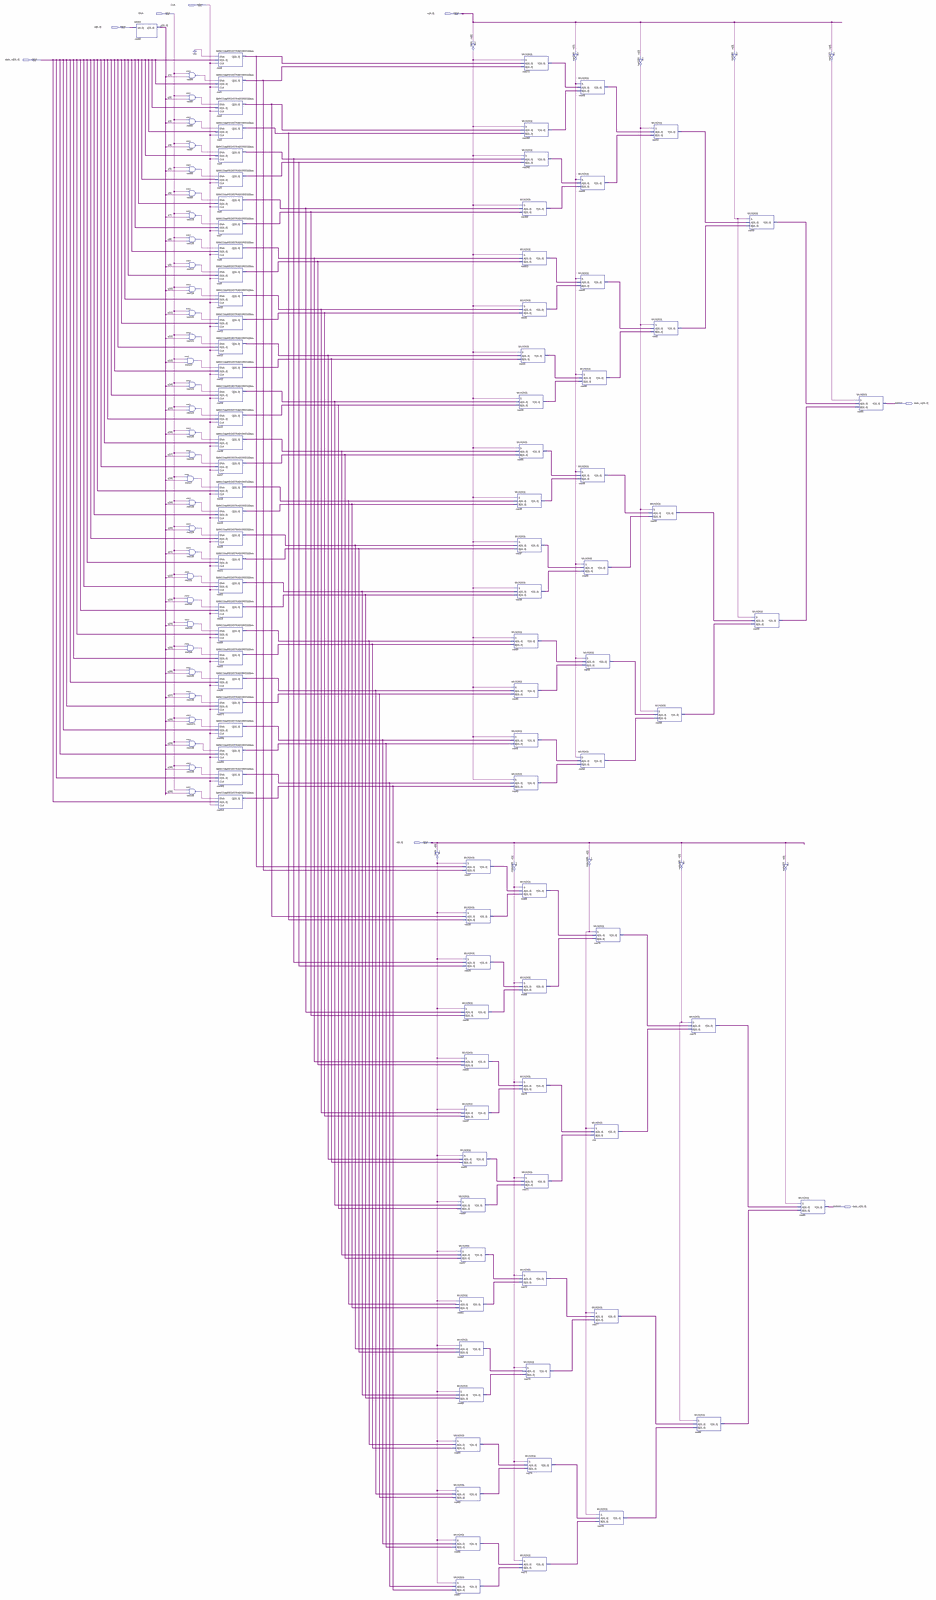
[diagram p0: schematic sheet, whole]
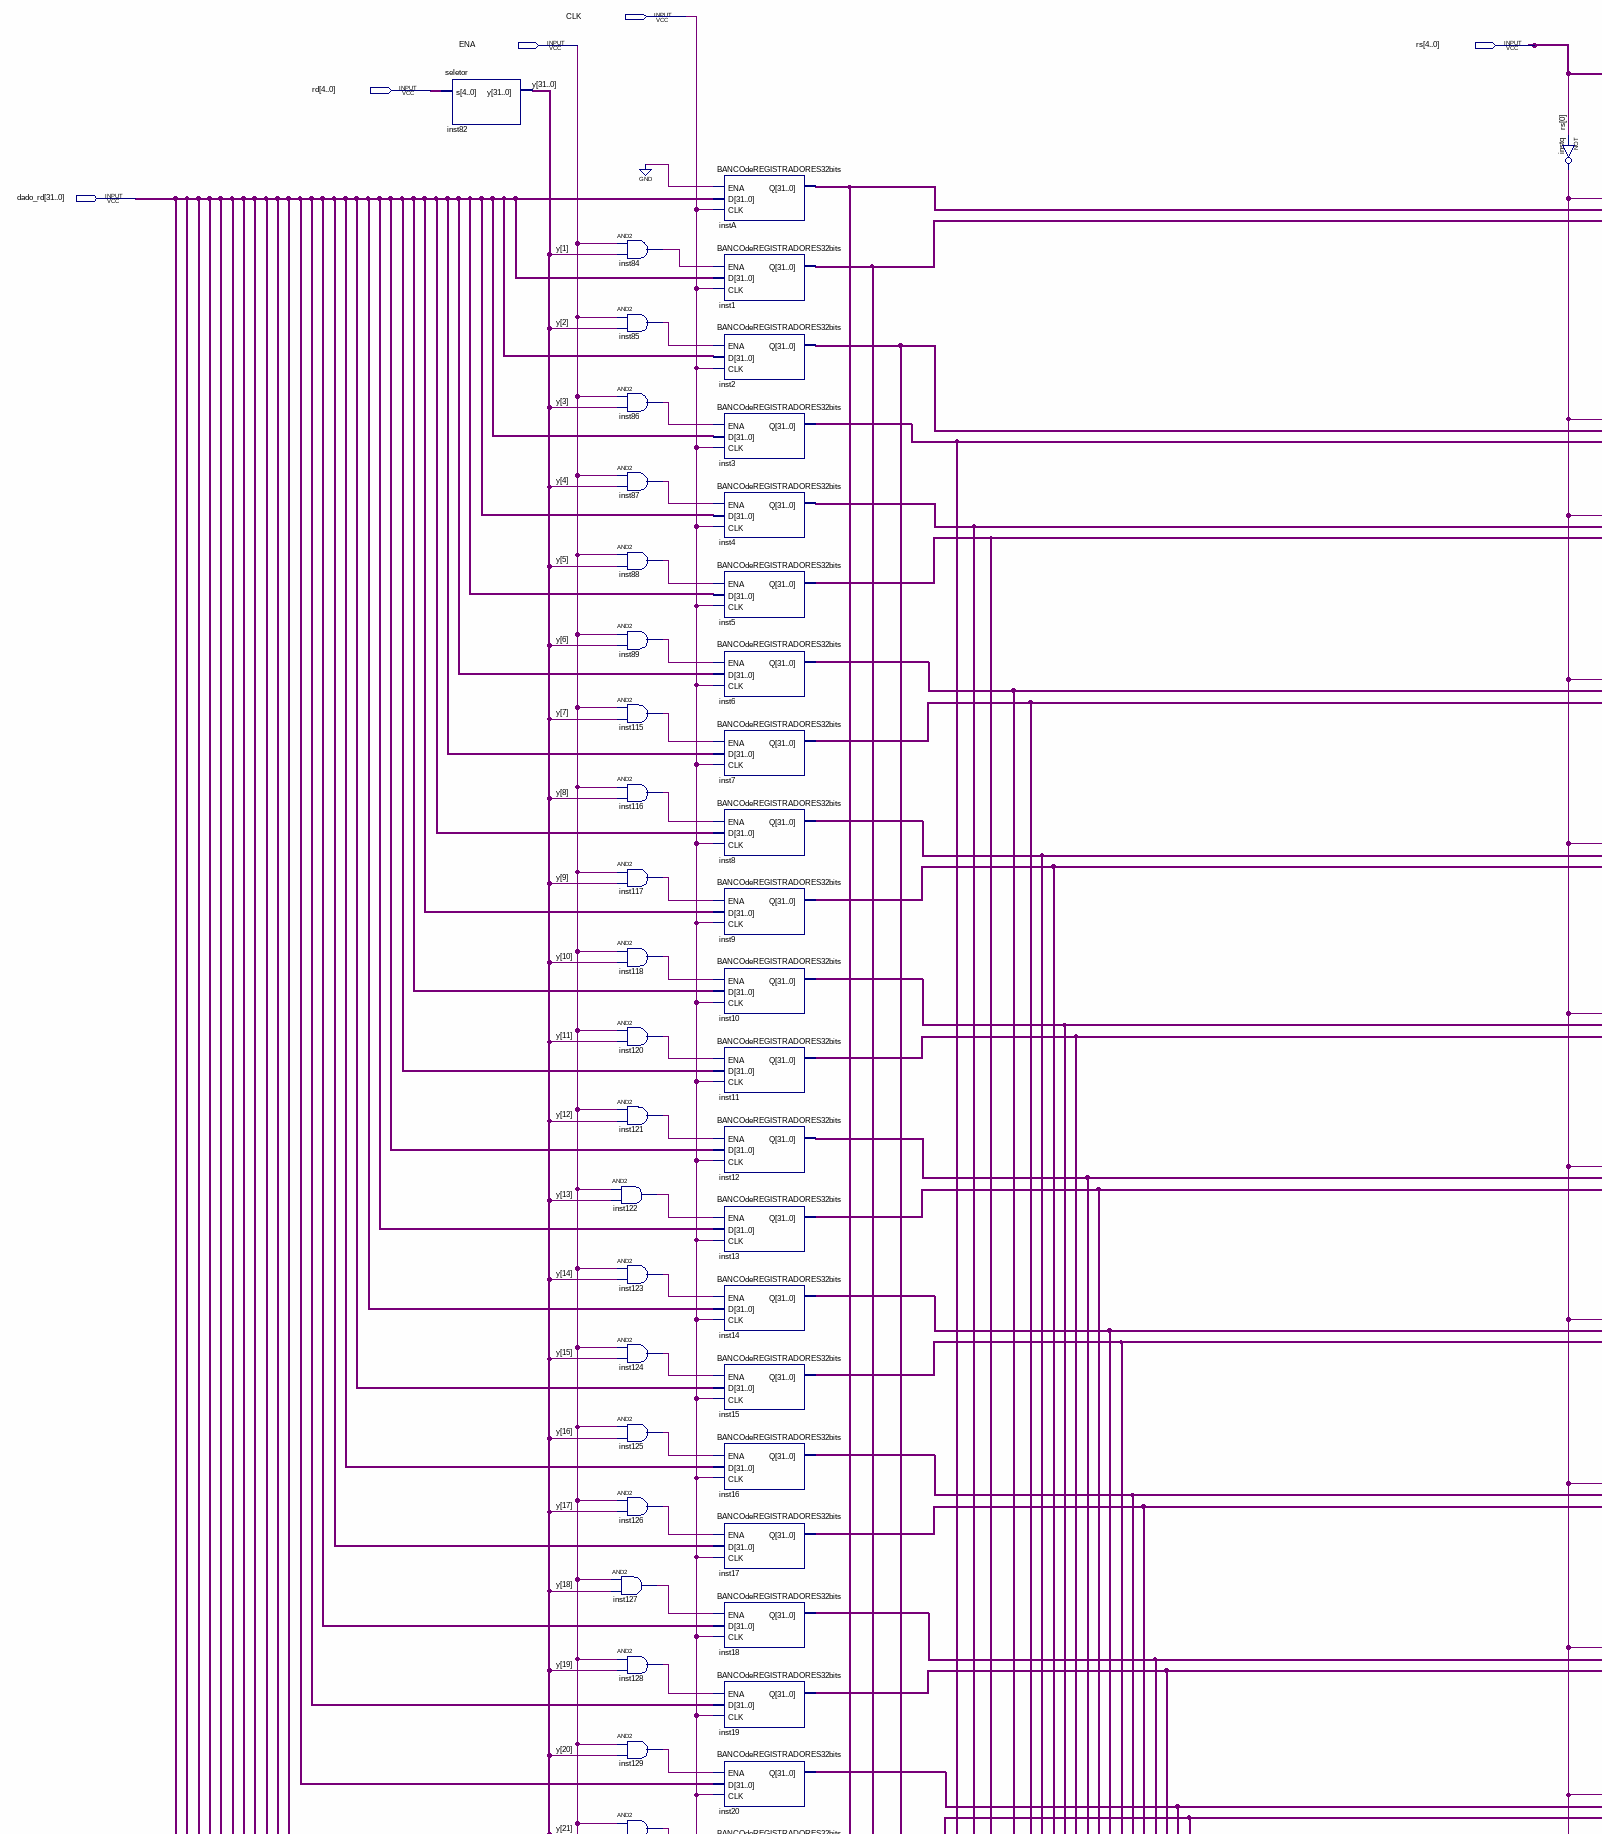
[diagram p1: schematic sheet, upper left part]
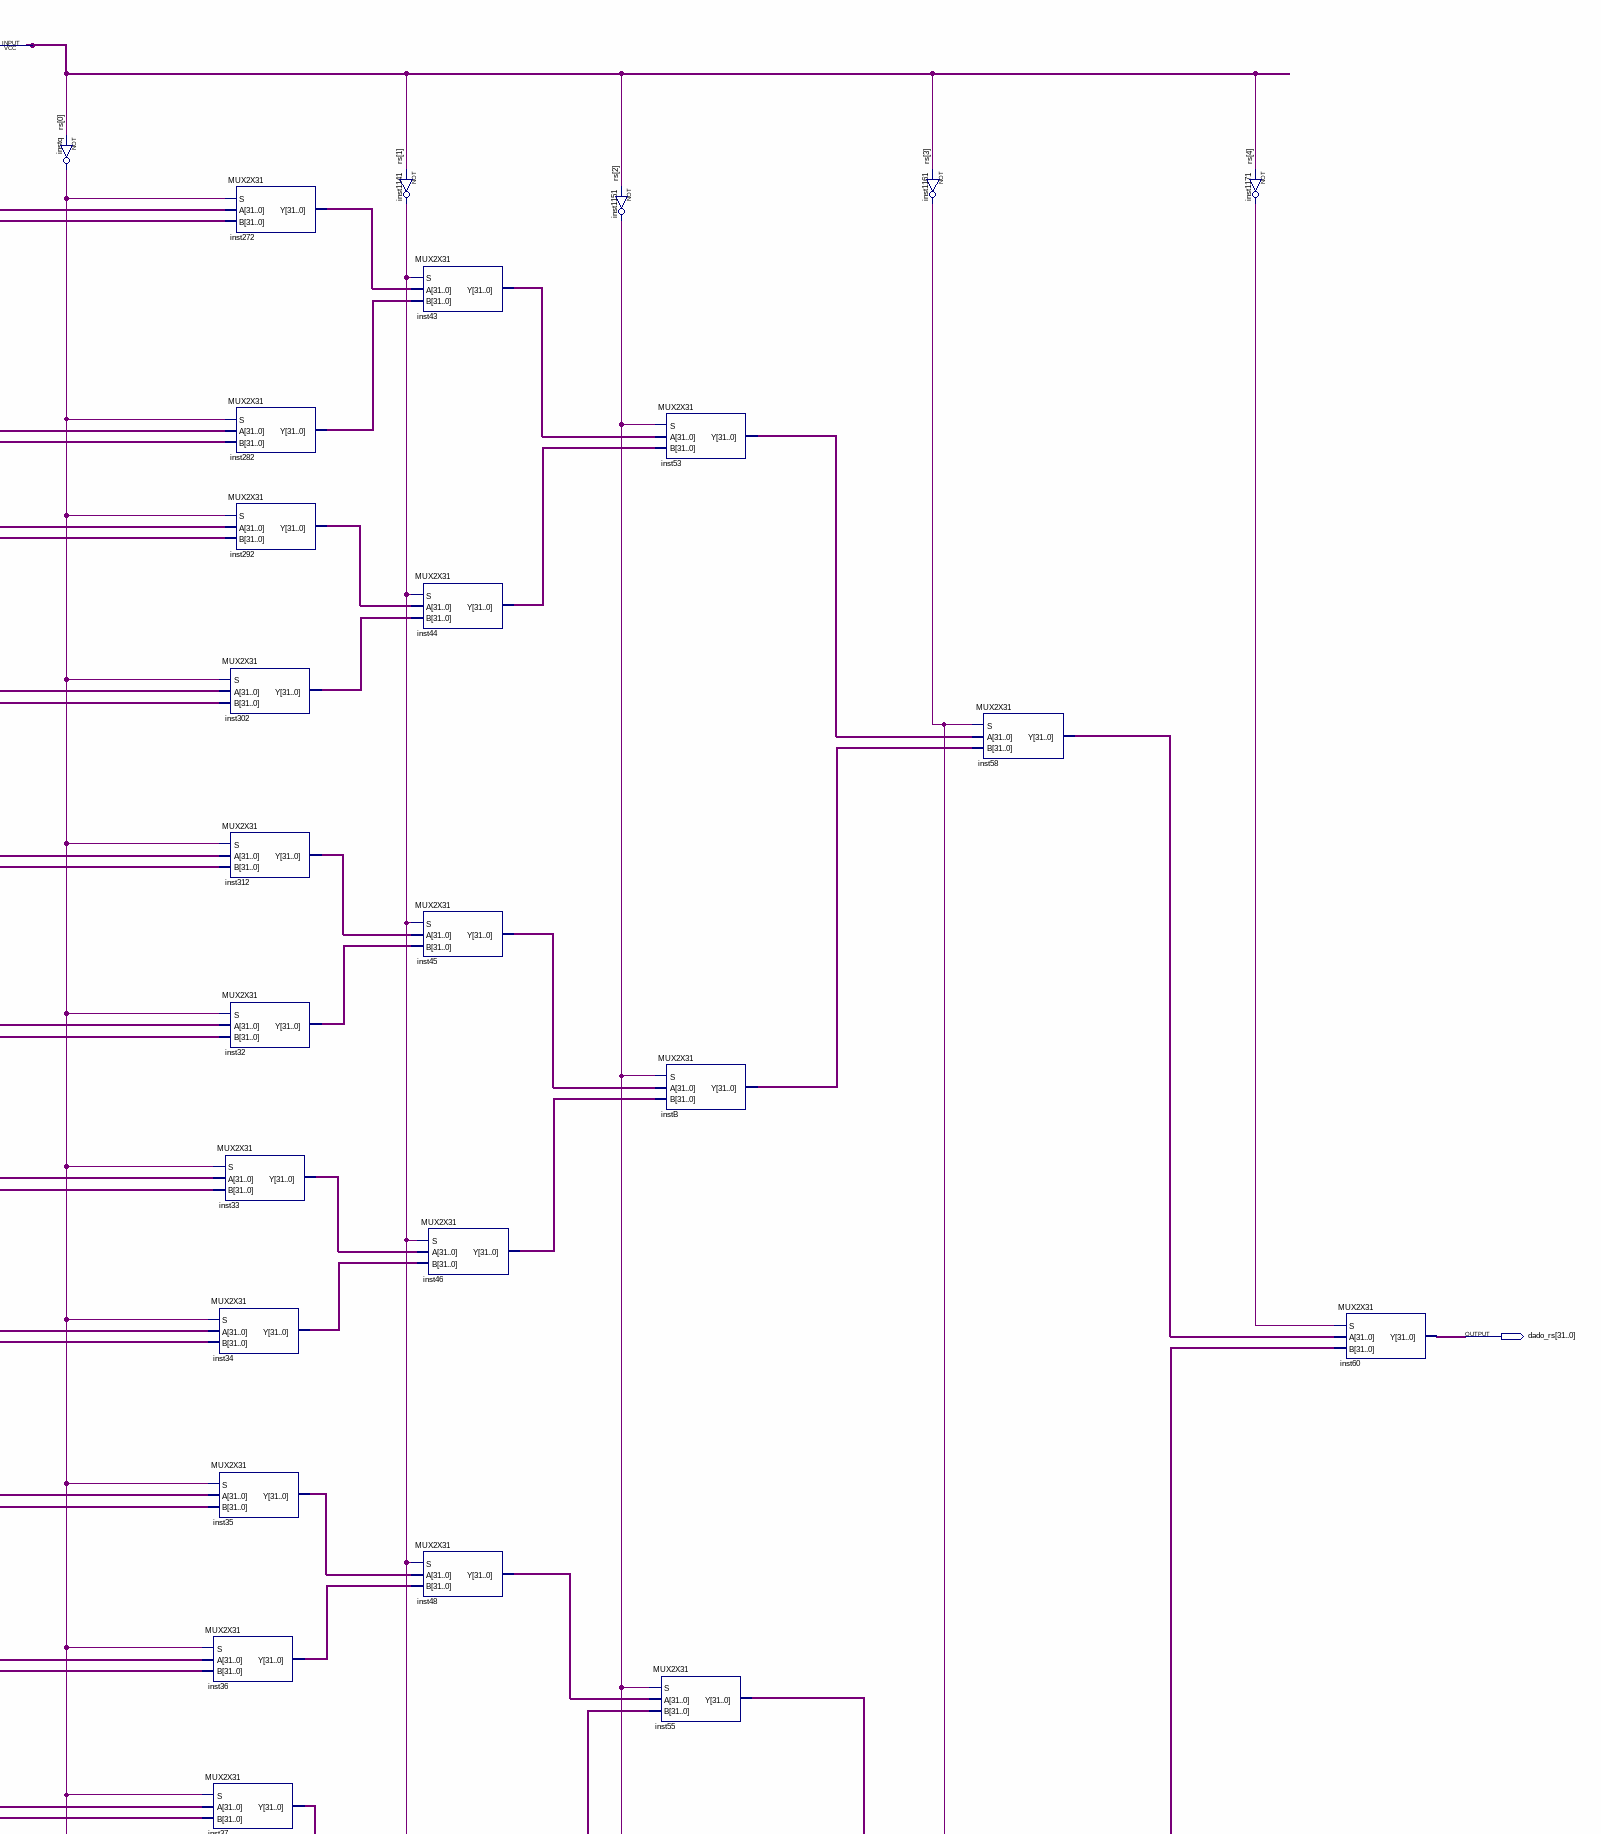
[diagram p2: schematic sheet, upper right part]
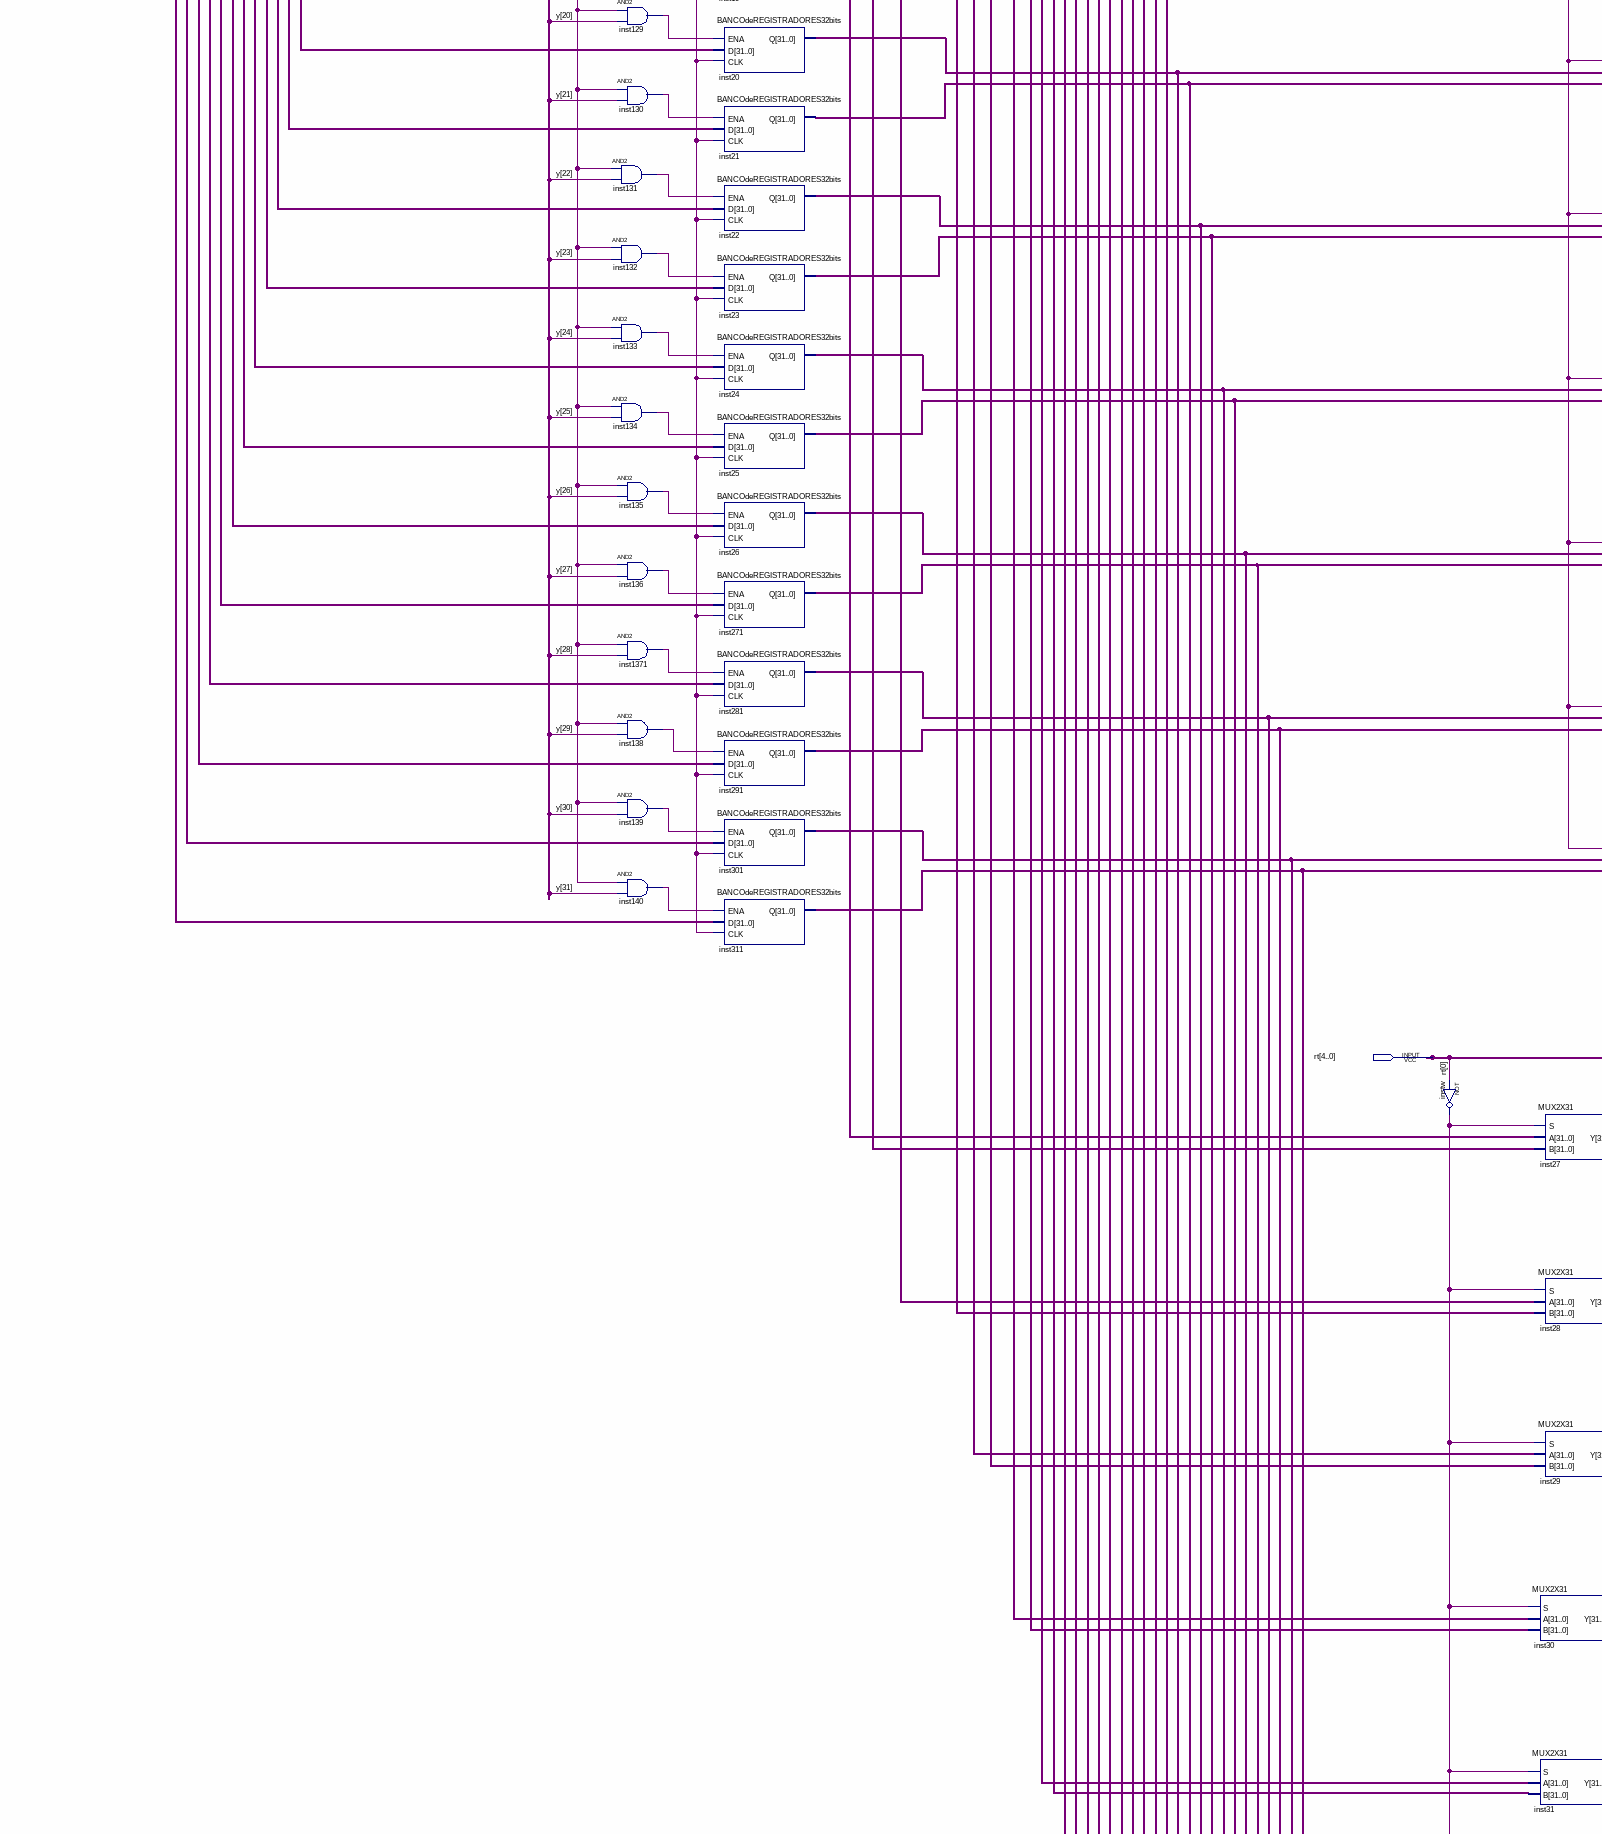
[diagram p3: schematic sheet, middle left part]
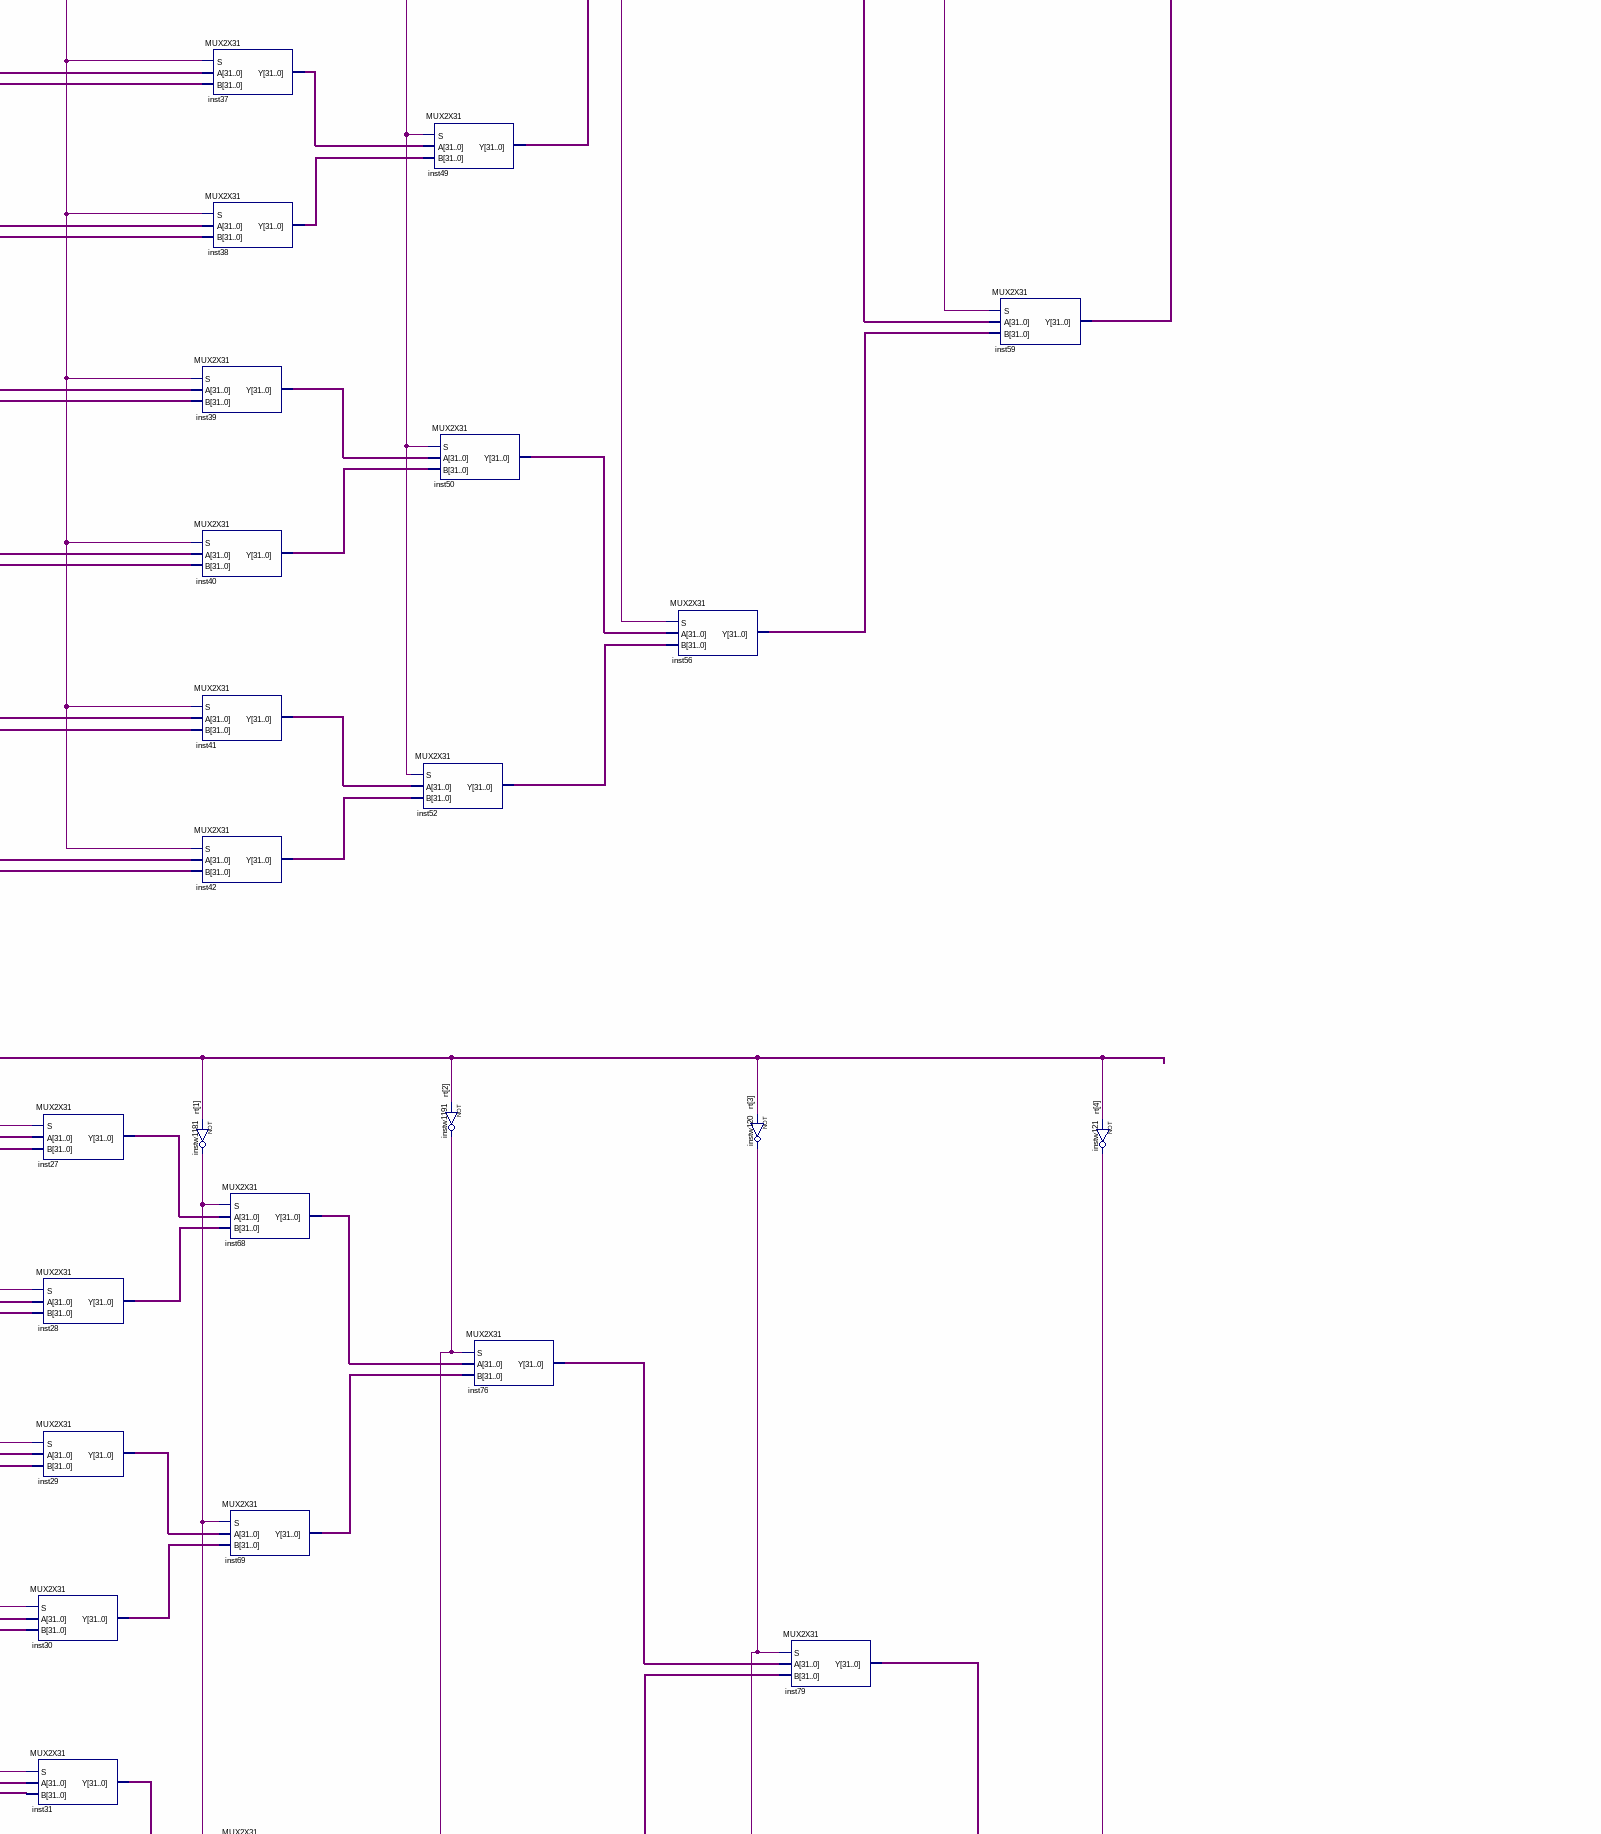
[diagram p4: schematic sheet, middle right part]
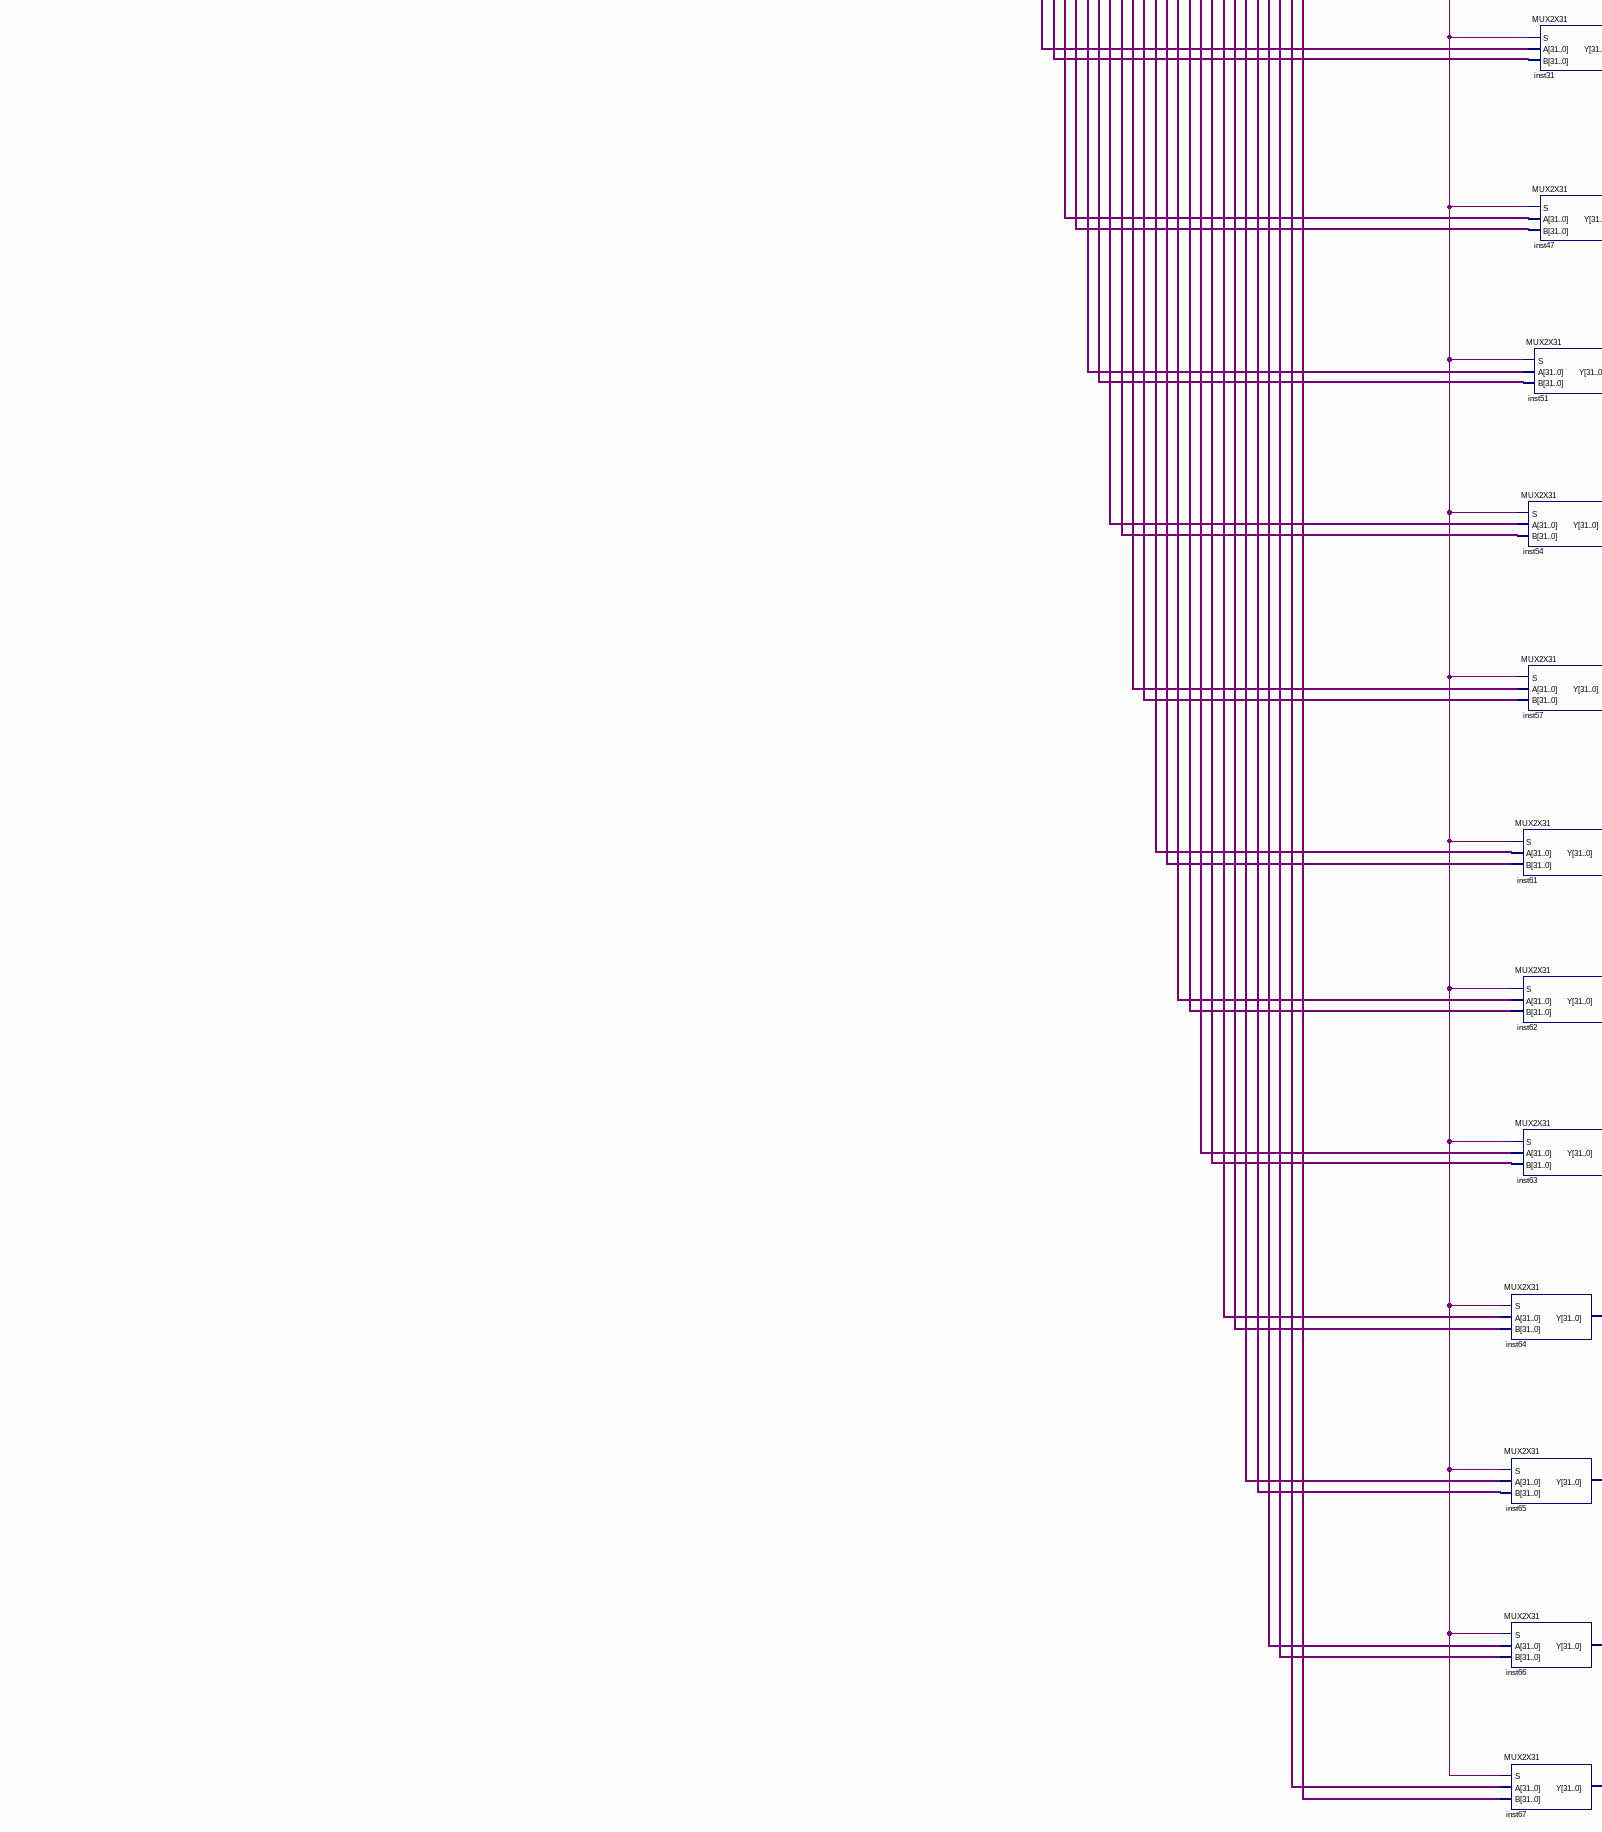
[diagram p5: schematic sheet, lower left part]
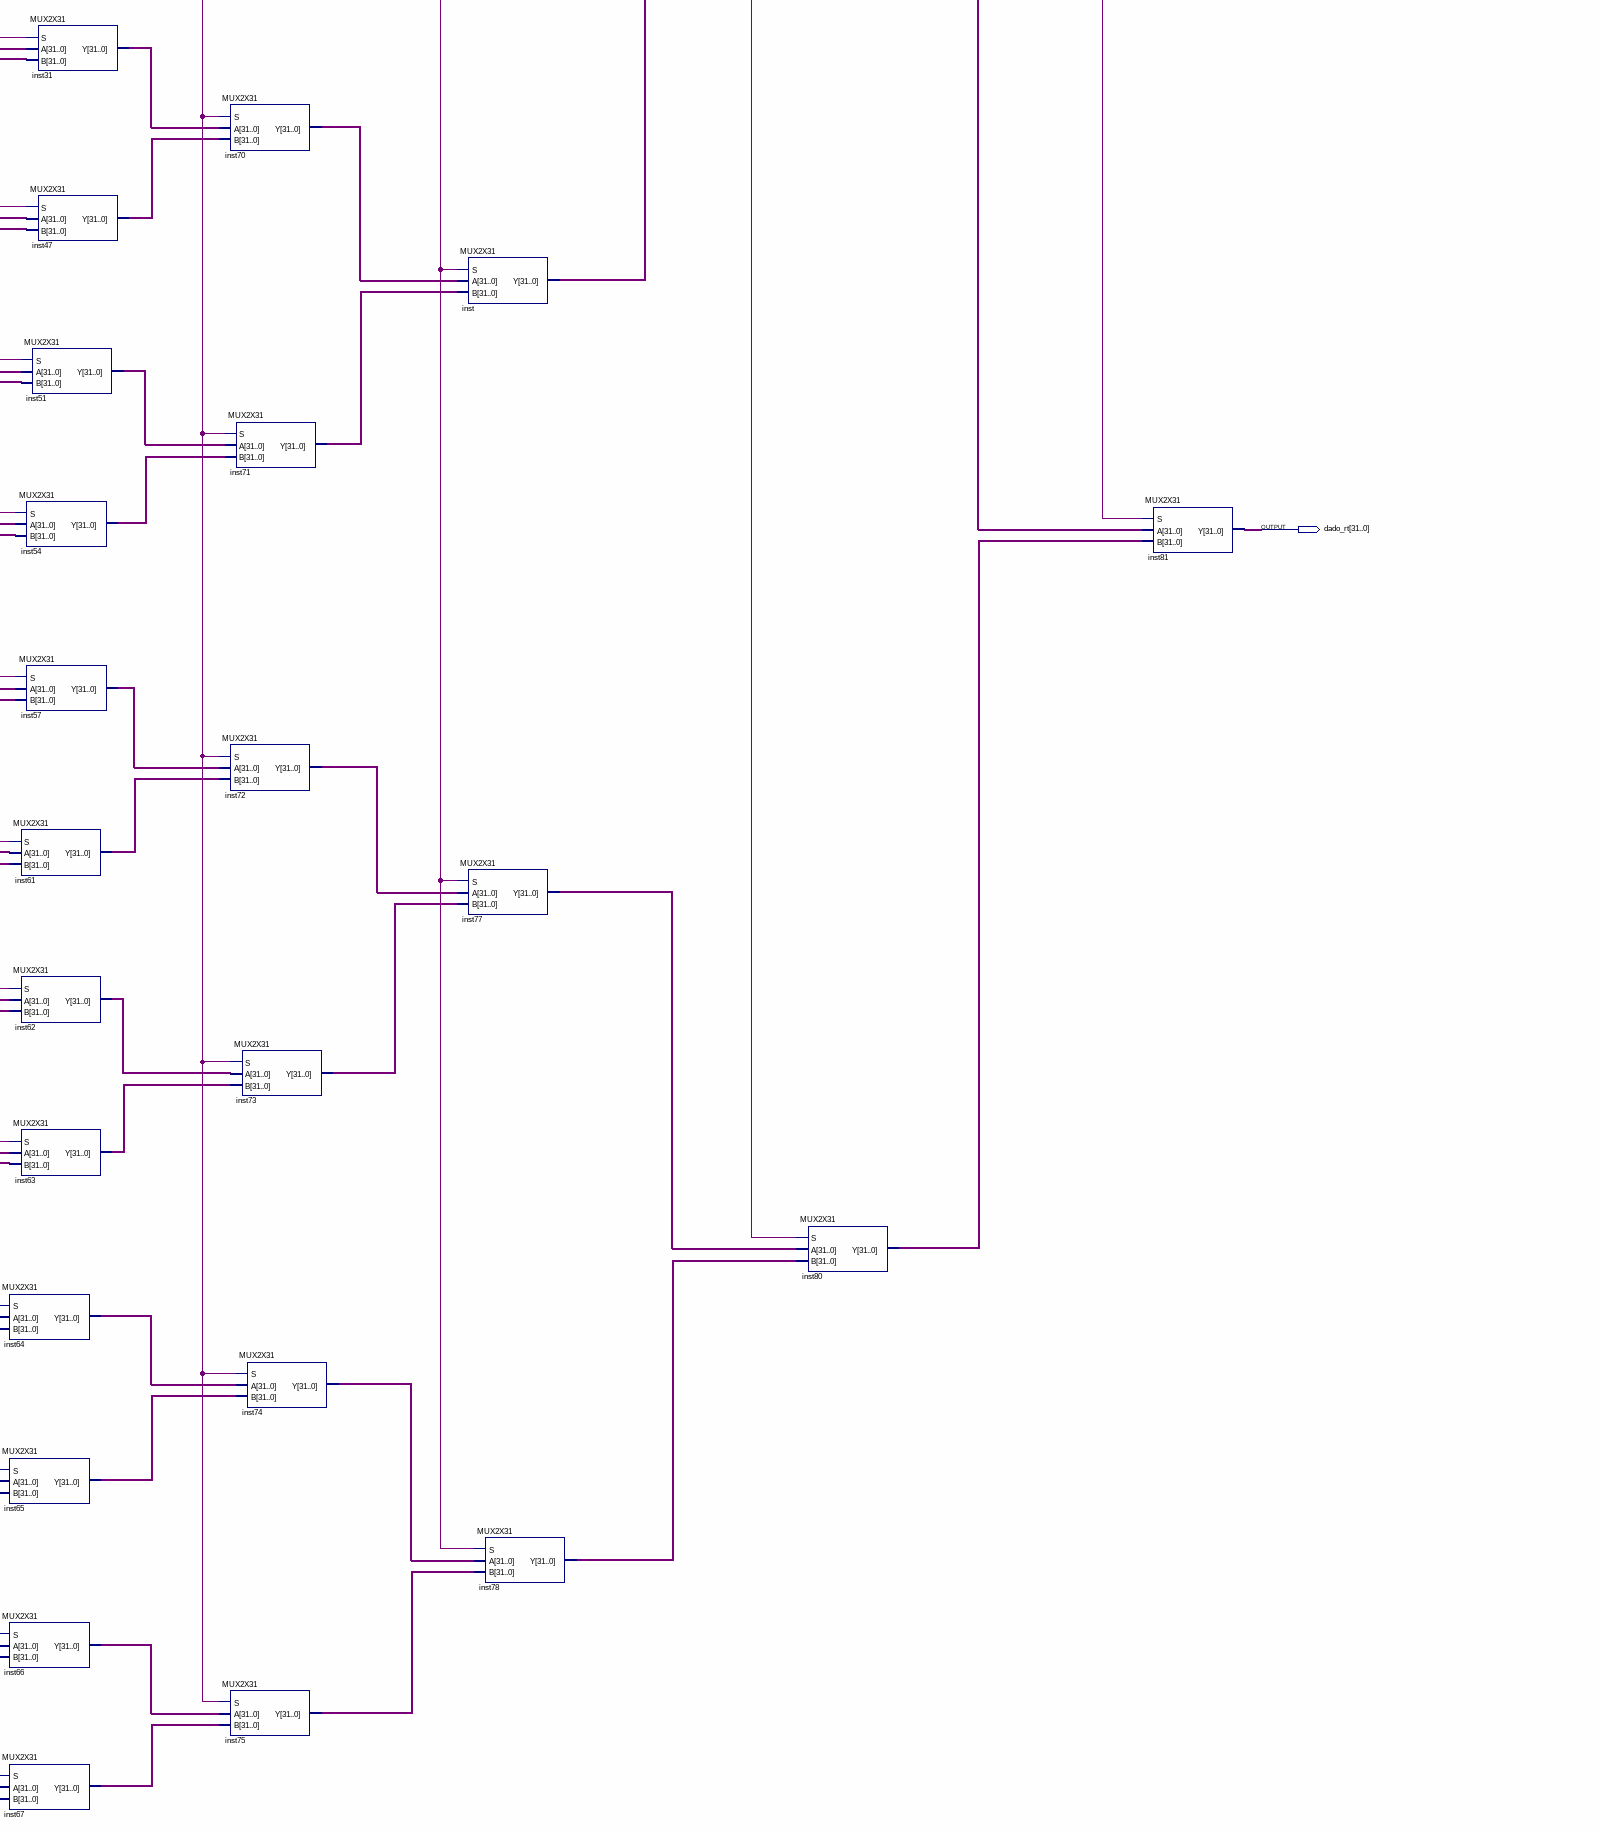
[diagram p6: schematic sheet, lower right part]
// Quartus schematic REGISTRADORES.bdf as structural Verilog: 136 symbols, 8 pins
module REGISTRADORES (
  input  CLK,
  input  ENA,
  input  [4:0] rs,
  input  [4:0] rd,
  input  [31:0] dado_rd,
  input  [4:0] rt,
  output [31:0] dado_rs,
  output [31:0] dado_rt
);

  wire inst84_out, inst85_out, inst86_out, inst87_out, inst88_out, inst89_out, inst115_out, inst116_out,
       inst117_out, inst118_out, inst120_out, inst121_out, inst122_out, inst123_out, inst124_out,
       inst125_out, inst126_out, inst127_out, inst128_out, inst129_out, inst130_out, inst131_out,
       inst132_out, inst133_out, inst134_out, inst135_out, inst136_out, inst138_out, inst139_out,
       inst140_out, inst1141_out, inst1151_out, inst1161_out, inst1171_out, inst1371_out, instq_out,
       instw120_out, instw121_out, instw1181_out, instw1191_out, instw_out;
  wire [31:0] inst1_q, inst2_q, inst3_q, inst4_q, inst5_q, inst6_q, inst7_q, inst8_q, inst9_q, inst10_q,
       inst11_q, inst12_q, inst13_q, inst14_q, inst15_q, inst16_q, inst17_q, inst18_q, inst19_q, inst20_q,
       inst21_q, inst22_q, inst23_q, inst24_q, inst25_q, inst26_q, inst27_y, inst28_y, inst29_y, inst30_y,
       inst31_y, inst32_y, inst33_y, inst34_y, inst35_y, inst36_y, inst37_y, inst38_y, inst39_y, inst40_y,
       inst41_y, inst42_y, inst43_y, inst44_y, inst45_y, inst46_y, inst47_y, inst48_y, inst49_y, inst50_y,
       inst51_y, inst52_y, inst53_y, inst54_y, inst55_y, inst56_y, inst57_y, inst58_y, inst59_y, inst61_y,
       inst62_y, inst63_y, inst64_y, inst65_y, inst66_y, inst67_y, inst68_y, inst69_y, inst70_y, inst71_y,
       inst72_y, inst73_y, inst74_y, inst75_y, inst76_y, inst77_y, inst78_y, inst79_y, inst80_y, inst271_q,
       inst272_y, inst281_q, inst282_y, inst291_q, inst292_y, inst301_q, inst302_y, inst311_q, inst312_y,
       inst_y, instA_q, instB_y, y;

  seletor inst82 (.s(rd), .y(y));
  and inst84 (inst84_out, ENA, y[1]);
  and inst85 (inst85_out, ENA, y[2]);
  and inst86 (inst86_out, ENA, y[3]);
  and inst87 (inst87_out, ENA, y[4]);
  and inst88 (inst88_out, ENA, y[5]);
  and inst89 (inst89_out, ENA, y[6]);
  and inst115 (inst115_out, ENA, y[7]);
  and inst116 (inst116_out, ENA, y[8]);
  and inst117 (inst117_out, ENA, y[9]);
  and inst118 (inst118_out, ENA, y[10]);
  and inst120 (inst120_out, ENA, y[11]);
  and inst121 (inst121_out, ENA, y[12]);
  and inst122 (inst122_out, ENA, y[13]);
  and inst123 (inst123_out, ENA, y[14]);
  and inst124 (inst124_out, ENA, y[15]);
  and inst125 (inst125_out, ENA, y[16]);
  and inst126 (inst126_out, ENA, y[17]);
  and inst127 (inst127_out, ENA, y[18]);
  and inst128 (inst128_out, ENA, y[19]);
  and inst129 (inst129_out, ENA, y[20]);
  and inst130 (inst130_out, ENA, y[21]);
  and inst131 (inst131_out, ENA, y[22]);
  and inst132 (inst132_out, ENA, y[23]);
  and inst133 (inst133_out, ENA, y[24]);
  and inst134 (inst134_out, ENA, y[25]);
  and inst135 (inst135_out, ENA, y[26]);
  and inst136 (inst136_out, ENA, y[27]);
  and inst1371 (inst1371_out, ENA, y[28]);
  and inst138 (inst138_out, ENA, y[29]);
  and inst139 (inst139_out, ENA, y[30]);
  and inst140 (inst140_out, ENA, y[31]);
  BANCOdeREGISTRADORES32bits instA (.ENA(1'b0), .D(dado_rd), .CLK(CLK), .Q(instA_q));
  BANCOdeREGISTRADORES32bits inst1 (.ENA(inst84_out), .D(dado_rd), .CLK(CLK), .Q(inst1_q));
  BANCOdeREGISTRADORES32bits inst2 (.ENA(inst85_out), .D(dado_rd), .CLK(CLK), .Q(inst2_q));
  BANCOdeREGISTRADORES32bits inst3 (.ENA(inst86_out), .D(dado_rd), .CLK(CLK), .Q(inst3_q));
  BANCOdeREGISTRADORES32bits inst4 (.ENA(inst87_out), .D(dado_rd), .CLK(CLK), .Q(inst4_q));
  BANCOdeREGISTRADORES32bits inst5 (.ENA(inst88_out), .D(dado_rd), .CLK(CLK), .Q(inst5_q));
  BANCOdeREGISTRADORES32bits inst6 (.ENA(inst89_out), .D(dado_rd), .CLK(CLK), .Q(inst6_q));
  BANCOdeREGISTRADORES32bits inst7 (.ENA(inst115_out), .D(dado_rd), .CLK(CLK), .Q(inst7_q));
  BANCOdeREGISTRADORES32bits inst8 (.ENA(inst116_out), .D(dado_rd), .CLK(CLK), .Q(inst8_q));
  BANCOdeREGISTRADORES32bits inst9 (.ENA(inst117_out), .D(dado_rd), .CLK(CLK), .Q(inst9_q));
  BANCOdeREGISTRADORES32bits inst10 (.ENA(inst118_out), .D(dado_rd), .CLK(CLK), .Q(inst10_q));
  BANCOdeREGISTRADORES32bits inst11 (.ENA(inst120_out), .D(dado_rd), .CLK(CLK), .Q(inst11_q));
  BANCOdeREGISTRADORES32bits inst12 (.ENA(inst121_out), .D(dado_rd), .CLK(CLK), .Q(inst12_q));
  BANCOdeREGISTRADORES32bits inst13 (.ENA(inst122_out), .D(dado_rd), .CLK(CLK), .Q(inst13_q));
  BANCOdeREGISTRADORES32bits inst14 (.ENA(inst123_out), .D(dado_rd), .CLK(CLK), .Q(inst14_q));
  BANCOdeREGISTRADORES32bits inst15 (.ENA(inst124_out), .D(dado_rd), .CLK(CLK), .Q(inst15_q));
  BANCOdeREGISTRADORES32bits inst16 (.ENA(inst125_out), .D(dado_rd), .CLK(CLK), .Q(inst16_q));
  BANCOdeREGISTRADORES32bits inst17 (.ENA(inst126_out), .D(dado_rd), .CLK(CLK), .Q(inst17_q));
  BANCOdeREGISTRADORES32bits inst18 (.ENA(inst127_out), .D(dado_rd), .CLK(CLK), .Q(inst18_q));
  BANCOdeREGISTRADORES32bits inst19 (.ENA(inst128_out), .D(dado_rd), .CLK(CLK), .Q(inst19_q));
  BANCOdeREGISTRADORES32bits inst20 (.ENA(inst129_out), .D(dado_rd), .CLK(CLK), .Q(inst20_q));
  BANCOdeREGISTRADORES32bits inst21 (.ENA(inst130_out), .D(dado_rd), .CLK(CLK), .Q(inst21_q));
  BANCOdeREGISTRADORES32bits inst22 (.ENA(inst131_out), .D(dado_rd), .CLK(CLK), .Q(inst22_q));
  BANCOdeREGISTRADORES32bits inst23 (.ENA(inst132_out), .D(dado_rd), .CLK(CLK), .Q(inst23_q));
  BANCOdeREGISTRADORES32bits inst24 (.ENA(inst133_out), .D(dado_rd), .CLK(CLK), .Q(inst24_q));
  BANCOdeREGISTRADORES32bits inst25 (.ENA(inst134_out), .D(dado_rd), .CLK(CLK), .Q(inst25_q));
  BANCOdeREGISTRADORES32bits inst26 (.ENA(inst135_out), .D(dado_rd), .CLK(CLK), .Q(inst26_q));
  BANCOdeREGISTRADORES32bits inst271 (.ENA(inst136_out), .D(dado_rd), .CLK(CLK), .Q(inst271_q));
  BANCOdeREGISTRADORES32bits inst281 (.ENA(inst1371_out), .D(dado_rd), .CLK(CLK), .Q(inst281_q));
  BANCOdeREGISTRADORES32bits inst291 (.ENA(inst138_out), .D(dado_rd), .CLK(CLK), .Q(inst291_q));
  BANCOdeREGISTRADORES32bits inst301 (.ENA(inst139_out), .D(dado_rd), .CLK(CLK), .Q(inst301_q));
  BANCOdeREGISTRADORES32bits inst311 (.ENA(inst140_out), .D(dado_rd), .CLK(CLK), .Q(inst311_q));
  not instw (instw_out, rt[0]);
  MUX2X31 inst27 (.S(instw_out), .A(instA_q), .B(inst1_q), .Y(inst27_y));
  MUX2X31 inst28 (.S(instw_out), .A(inst2_q), .B(inst3_q), .Y(inst28_y));
  MUX2X31 inst29 (.S(instw_out), .A(inst4_q), .B(inst5_q), .Y(inst29_y));
  MUX2X31 inst30 (.S(instw_out), .A(inst6_q), .B(inst7_q), .Y(inst30_y));
  MUX2X31 inst31 (.S(instw_out), .A(inst8_q), .B(inst9_q), .Y(inst31_y));
  MUX2X31 inst47 (.S(instw_out), .A(inst10_q), .B(inst11_q), .Y(inst47_y));
  MUX2X31 inst51 (.S(instw_out), .A(inst12_q), .B(inst13_q), .Y(inst51_y));
  MUX2X31 inst54 (.S(instw_out), .A(inst14_q), .B(inst15_q), .Y(inst54_y));
  MUX2X31 inst57 (.S(instw_out), .A(inst16_q), .B(inst17_q), .Y(inst57_y));
  MUX2X31 inst61 (.S(instw_out), .A(inst18_q), .B(inst19_q), .Y(inst61_y));
  MUX2X31 inst62 (.S(instw_out), .A(inst20_q), .B(inst21_q), .Y(inst62_y));
  MUX2X31 inst63 (.S(instw_out), .A(inst22_q), .B(inst23_q), .Y(inst63_y));
  MUX2X31 inst64 (.S(instw_out), .A(inst24_q), .B(inst25_q), .Y(inst64_y));
  MUX2X31 inst65 (.S(instw_out), .A(inst26_q), .B(inst271_q), .Y(inst65_y));
  MUX2X31 inst66 (.S(instw_out), .A(inst281_q), .B(inst291_q), .Y(inst66_y));
  MUX2X31 inst67 (.S(instw_out), .A(inst301_q), .B(inst311_q), .Y(inst67_y));
  not instq (instq_out, rs[0]);
  MUX2X31 inst302 (.S(instq_out), .A(inst6_q), .B(inst7_q), .Y(inst302_y));
  MUX2X31 inst312 (.S(instq_out), .A(inst8_q), .B(inst9_q), .Y(inst312_y));
  MUX2X31 inst32 (.S(instq_out), .A(inst10_q), .B(inst11_q), .Y(inst32_y));
  MUX2X31 inst33 (.S(instq_out), .A(inst12_q), .B(inst13_q), .Y(inst33_y));
  MUX2X31 inst34 (.S(instq_out), .A(inst14_q), .B(inst15_q), .Y(inst34_y));
  MUX2X31 inst35 (.S(instq_out), .A(inst16_q), .B(inst17_q), .Y(inst35_y));
  MUX2X31 inst36 (.S(instq_out), .A(inst18_q), .B(inst19_q), .Y(inst36_y));
  MUX2X31 inst37 (.S(instq_out), .A(inst20_q), .B(inst21_q), .Y(inst37_y));
  MUX2X31 inst38 (.S(instq_out), .A(inst22_q), .B(inst23_q), .Y(inst38_y));
  MUX2X31 inst39 (.S(instq_out), .A(inst24_q), .B(inst25_q), .Y(inst39_y));
  MUX2X31 inst40 (.S(instq_out), .A(inst26_q), .B(inst271_q), .Y(inst40_y));
  MUX2X31 inst41 (.S(instq_out), .A(inst281_q), .B(inst291_q), .Y(inst41_y));
  MUX2X31 inst42 (.S(instq_out), .A(inst301_q), .B(inst311_q), .Y(inst42_y));
  not instw1181 (instw1181_out, rt[1]);
  MUX2X31 inst68 (.S(instw1181_out), .A(inst27_y), .B(inst28_y), .Y(inst68_y));
  MUX2X31 inst69 (.S(instw1181_out), .A(inst29_y), .B(inst30_y), .Y(inst69_y));
  MUX2X31 inst70 (.S(instw1181_out), .A(inst31_y), .B(inst47_y), .Y(inst70_y));
  MUX2X31 inst72 (.S(instw1181_out), .A(inst57_y), .B(inst61_y), .Y(inst72_y));
  MUX2X31 inst75 (.S(instw1181_out), .A(inst66_y), .B(inst67_y), .Y(inst75_y));
  MUX2X31 inst272 (.S(instq_out), .A(instA_q), .B(inst1_q), .Y(inst272_y));
  MUX2X31 inst282 (.S(instq_out), .A(inst2_q), .B(inst3_q), .Y(inst282_y));
  MUX2X31 inst292 (.S(instq_out), .A(inst4_q), .B(inst5_q), .Y(inst292_y));
  MUX2X31 inst71 (.S(instw1181_out), .A(inst51_y), .B(inst54_y), .Y(inst71_y));
  MUX2X31 inst73 (.S(instw1181_out), .A(inst62_y), .B(inst63_y), .Y(inst73_y));
  MUX2X31 inst74 (.S(instw1181_out), .A(inst64_y), .B(inst65_y), .Y(inst74_y));
  not inst1141 (inst1141_out, rs[1]);
  MUX2X31 inst43 (.S(inst1141_out), .A(inst272_y), .B(inst282_y), .Y(inst43_y));
  MUX2X31 inst44 (.S(inst1141_out), .A(inst292_y), .B(inst302_y), .Y(inst44_y));
  MUX2X31 inst45 (.S(inst1141_out), .A(inst312_y), .B(inst32_y), .Y(inst45_y));
  MUX2X31 inst46 (.S(inst1141_out), .A(inst33_y), .B(inst34_y), .Y(inst46_y));
  MUX2X31 inst48 (.S(inst1141_out), .A(inst35_y), .B(inst36_y), .Y(inst48_y));
  MUX2X31 inst49 (.S(inst1141_out), .A(inst37_y), .B(inst38_y), .Y(inst49_y));
  MUX2X31 inst50 (.S(inst1141_out), .A(inst39_y), .B(inst40_y), .Y(inst50_y));
  MUX2X31 inst52 (.S(inst1141_out), .A(inst41_y), .B(inst42_y), .Y(inst52_y));
  not instw1191 (instw1191_out, rt[2]);
  MUX2X31 inst76 (.S(instw1191_out), .A(inst68_y), .B(inst69_y), .Y(inst76_y));
  MUX2X31 inst (.S(instw1191_out), .A(inst70_y), .B(inst71_y), .Y(inst_y));
  MUX2X31 inst77 (.S(instw1191_out), .A(inst72_y), .B(inst73_y), .Y(inst77_y));
  MUX2X31 inst78 (.S(instw1191_out), .A(inst74_y), .B(inst75_y), .Y(inst78_y));
  not inst1151 (inst1151_out, rs[2]);
  MUX2X31 inst53 (.S(inst1151_out), .A(inst43_y), .B(inst44_y), .Y(inst53_y));
  MUX2X31 instB (.S(inst1151_out), .A(inst45_y), .B(inst46_y), .Y(instB_y));
  MUX2X31 inst55 (.S(inst1151_out), .A(inst48_y), .B(inst49_y), .Y(inst55_y));
  MUX2X31 inst56 (.S(inst1151_out), .A(inst50_y), .B(inst52_y), .Y(inst56_y));
  not instw120 (instw120_out, rt[3]);
  MUX2X31 inst79 (.S(instw120_out), .A(inst76_y), .B(inst_y), .Y(inst79_y));
  MUX2X31 inst80 (.S(instw120_out), .A(inst77_y), .B(inst78_y), .Y(inst80_y));
  not inst1161 (inst1161_out, rs[3]);
  MUX2X31 inst58 (.S(inst1161_out), .A(inst53_y), .B(instB_y), .Y(inst58_y));
  MUX2X31 inst59 (.S(inst1161_out), .A(inst55_y), .B(inst56_y), .Y(inst59_y));
  not instw121 (instw121_out, rt[4]);
  MUX2X31 inst81 (.S(instw121_out), .A(inst79_y), .B(inst80_y), .Y(dado_rt));
  not inst1171 (inst1171_out, rs[4]);
  MUX2X31 inst60 (.S(inst1171_out), .A(inst58_y), .B(inst59_y), .Y(dado_rs));
endmodule
